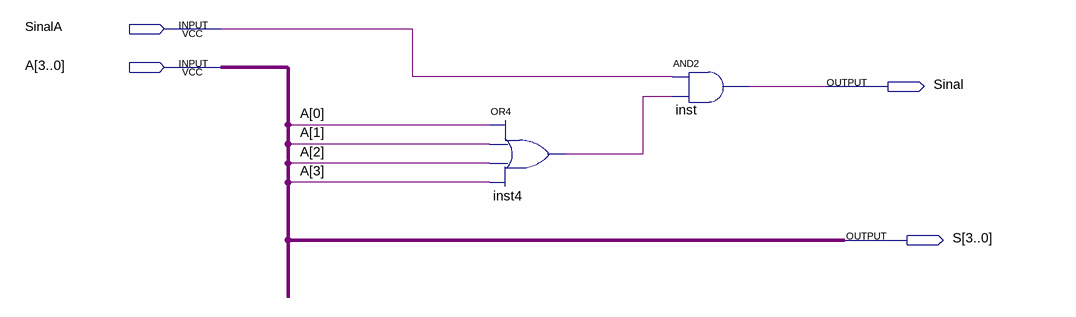
[diagram p0: schematic sheet]
// Quartus schematic zero.bdf as structural Verilog: 2 symbols, 4 pins
module zero (
  input  SinalA,
  input  [3:0] A,
  output Sinal,
  output [3:0] S
);

  wire inst4_out;

  or inst4 (inst4_out, A[0], A[1], A[2], A[3]);
  and inst (Sinal, SinalA, inst4_out);

  assign S = A;
endmodule
